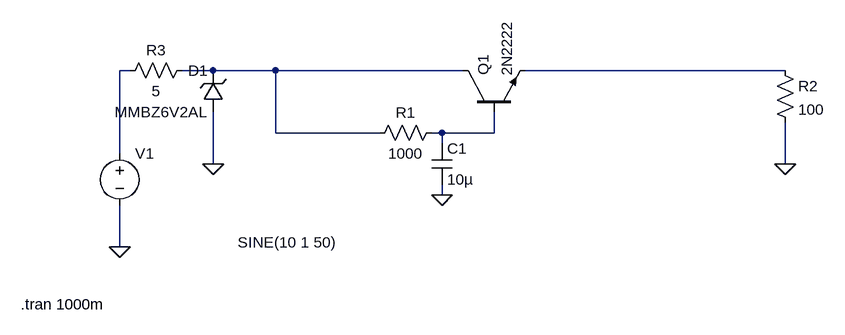
[diagram p0: schematic Draft1.asc]
Draft1.asc, the LTspice schematic file:
Version 4
SHEET 1 880 680
WIRE -576 32 -592 32
WIRE -448 32 -496 32
WIRE -352 32 -448 32
WIRE -64 32 -352 32
WIRE 432 32 32 32
WIRE -352 128 -352 32
WIRE -192 128 -352 128
WIRE -96 128 -112 128
WIRE -16 128 -16 96
WIRE -16 128 -96 128
WIRE -96 144 -96 128
WIRE -592 160 -592 32
WIRE -448 176 -448 96
WIRE 432 176 432 112
WIRE -96 224 -96 208
WIRE -592 304 -592 240
FLAG -96 224 0
FLAG -592 304 0
FLAG -448 176 0
FLAG 432 176 0
SYMBOL res -96 112 R90
WINDOW 0 0 56 VBottom 2
WINDOW 3 32 56 VTop 2
SYMATTR InstName R1
SYMATTR Value 1000
SYMBOL cap -112 144 R0
SYMATTR InstName C1
SYMATTR Value 10µ
SYMBOL npn -64 96 R270
SYMATTR InstName Q1
SYMATTR Value 2N2222
SYMBOL voltage -592 144 R0
WINDOW 123 0 0 Left 0
WINDOW 39 0 0 Left 0
WINDOW 3 182 153 Left 2
SYMATTR InstName V1
SYMATTR Value SINE(10 1 50)
SYMBOL zener -432 96 R180
WINDOW 0 24 64 Left 2
WINDOW 3 24 0 Left 2
SYMATTR InstName D1
SYMATTR Value MMBZ6V2AL
SYMBOL res -480 16 R90
WINDOW 0 0 56 VBottom 2
WINDOW 3 32 56 VTop 2
SYMATTR InstName R3
SYMATTR Value 5
SYMBOL res 416 16 R0
SYMATTR InstName R2
SYMATTR Value 100
TEXT -744 392 Left 2 !.tran 1000m

The netlist it stands for:
* Draft1.asc
R1 N004 N002 1000
C1 N004 0 10µ
Q1 N002 N004 N003 0 2N2222
V1 N001 0 SINE(10 1 50)
D1 0 N002 MMBZ6V2AL
R3 N002 N001 5
R2 N003 0 100
.model D D
.lib standard.dio
.model NPN NPN
.model PNP PNP
.lib standard.bjt
.tran 1000m
.backanno
.end